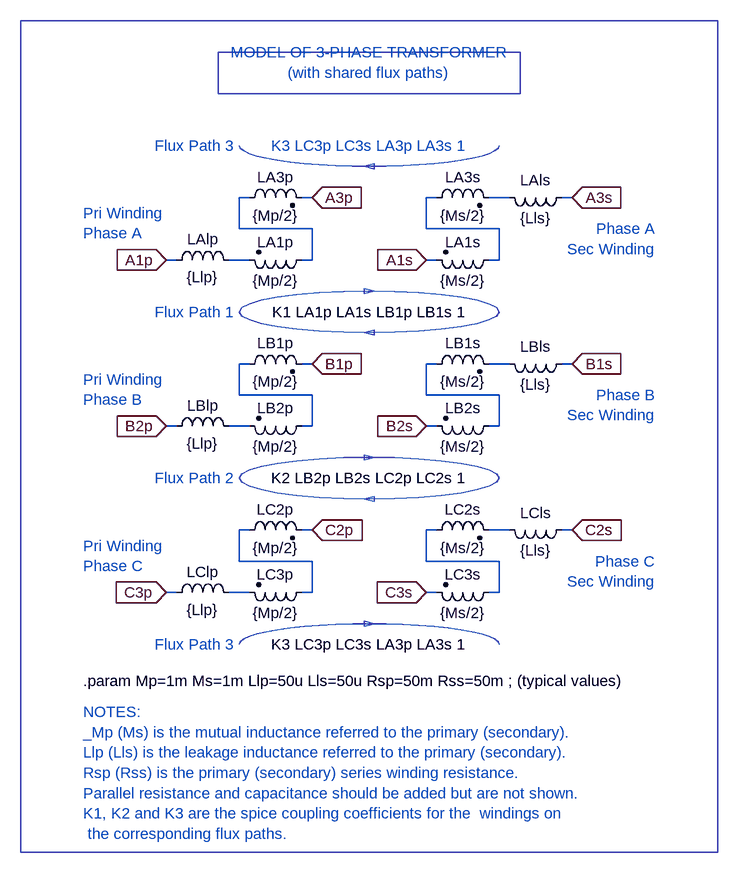
[diagram p0: schematic 3-phase_transformer.asc]
3-phase_transformer.asc, the LTspice schematic file:
Version 4
SHEET 1 1000 948
WIRE 112 32 96 32
WIRE 112 288 96 288
WIRE 112 544 96 544
WIRE 208 -16 208 -64
WIRE 208 240 208 192
WIRE 208 496 208 448
WIRE 224 -64 208 -64
WIRE 224 32 192 32
WIRE 224 192 208 192
WIRE 224 288 192 288
WIRE 224 448 208 448
WIRE 224 544 192 544
WIRE 320 -64 304 -64
WIRE 320 -16 208 -16
WIRE 320 32 304 32
WIRE 320 32 320 -16
WIRE 320 192 304 192
WIRE 320 240 208 240
WIRE 320 288 304 288
WIRE 320 288 320 240
WIRE 320 448 304 448
WIRE 320 496 208 496
WIRE 320 544 304 544
WIRE 320 544 320 496
WIRE 496 -16 496 -64
WIRE 496 240 496 192
WIRE 496 496 496 448
WIRE 512 -64 496 -64
WIRE 512 32 496 32
WIRE 512 192 496 192
WIRE 512 288 496 288
WIRE 512 448 496 448
WIRE 512 544 496 544
WIRE 608 -16 496 -16
WIRE 608 32 592 32
WIRE 608 32 608 -16
WIRE 608 240 496 240
WIRE 608 288 592 288
WIRE 608 288 608 240
WIRE 608 496 496 496
WIRE 608 544 592 544
WIRE 608 544 608 496
WIRE 624 -64 592 -64
WIRE 624 192 592 192
WIRE 624 448 592 448
WIRE 720 -64 704 -64
WIRE 720 192 704 192
WIRE 720 448 704 448
FLAG 720 -64 A3s
IOPIN 720 -64 In
FLAG 496 32 A1s
IOPIN 496 32 In
FLAG 720 192 B1s
IOPIN 720 192 In
FLAG 720 448 C2s
IOPIN 720 448 In
FLAG 496 288 B2s
IOPIN 496 288 In
FLAG 496 544 C3s
IOPIN 496 544 In
FLAG 320 -64 A3p
IOPIN 320 -64 In
FLAG 320 192 B1p
IOPIN 320 192 In
FLAG 320 448 C2p
IOPIN 320 448 In
FLAG 96 32 A1p
IOPIN 96 32 In
FLAG 96 288 B2p
IOPIN 96 288 In
FLAG 96 544 C3p
IOPIN 96 544 In
SYMBOL ind2 208 -48 R270
WINDOW 0 32 56 VTop 0
WINDOW 3 4 56 VBottom 0
SYMATTR InstName LA3p
SYMATTR Value {Mp/2}
SYMATTR Type ind
SYMBOL ind2 320 16 R90
WINDOW 0 4 56 VBottom 0
WINDOW 3 32 56 VTop 0
SYMATTR InstName LA1p
SYMATTR Value {Mp/2}
SYMATTR Type ind
SYMBOL ind2 208 208 R270
WINDOW 0 32 56 VTop 0
WINDOW 3 4 56 VBottom 0
SYMATTR InstName LB1p
SYMATTR Value {Mp/2}
SYMATTR Type ind
SYMBOL ind2 320 272 R90
WINDOW 0 4 56 VBottom 0
WINDOW 3 32 56 VTop 0
SYMATTR InstName LB2p
SYMATTR Value {Mp/2}
SYMATTR Type ind
SYMBOL ind2 208 464 R270
WINDOW 0 32 56 VTop 0
WINDOW 3 4 56 VBottom 0
SYMATTR InstName LC2p
SYMATTR Value {Mp/2}
SYMATTR Type ind
SYMBOL ind2 320 528 R90
WINDOW 0 4 56 VBottom 0
WINDOW 3 32 56 VTop 0
SYMATTR InstName LC3p
SYMATTR Value {Mp/2}
SYMATTR Type ind
SYMBOL ind2 496 -48 R270
WINDOW 0 32 56 VTop 0
WINDOW 3 4 56 VBottom 0
SYMATTR InstName LA3s
SYMATTR Value {Ms/2}
SYMATTR Type ind
SYMBOL ind2 608 16 R90
WINDOW 0 4 56 VBottom 0
WINDOW 3 32 56 VTop 0
SYMATTR InstName LA1s
SYMATTR Value {Ms/2}
SYMATTR Type ind
SYMBOL ind2 496 208 R270
WINDOW 0 32 56 VTop 0
WINDOW 3 4 56 VBottom 0
SYMATTR InstName LB1s
SYMATTR Value {Ms/2}
SYMATTR Type ind
SYMBOL ind2 608 272 R90
WINDOW 0 4 56 VBottom 0
WINDOW 3 32 56 VTop 0
SYMATTR InstName LB2s
SYMATTR Value {Ms/2}
SYMATTR Type ind
SYMBOL ind2 496 464 R270
WINDOW 0 32 56 VTop 0
WINDOW 3 4 56 VBottom 0
SYMATTR InstName LC2s
SYMATTR Value {Ms/2}
SYMATTR Type ind
SYMBOL ind2 608 528 R90
WINDOW 0 4 56 VBottom 0
WINDOW 3 32 56 VTop 0
SYMATTR InstName LC3s
SYMATTR Value {Ms/2}
SYMATTR Type ind
SYMBOL ind 96 48 R270
WINDOW 0 32 56 VTop 0
WINDOW 3 5 56 VBottom 0
SYMATTR InstName LAlp
SYMATTR Value {Llp}
SYMATTR SpiceLine Rser={Rsp}
SYMBOL ind 720 -80 R90
WINDOW 0 5 56 VBottom 0
WINDOW 3 32 56 VTop 0
SYMATTR InstName LAls
SYMATTR Value {Lls}
SYMATTR SpiceLine Rser={Rss}
SYMBOL ind 96 304 R270
WINDOW 0 32 56 VTop 0
WINDOW 3 5 56 VBottom 0
SYMATTR InstName LBlp
SYMATTR Value {Llp}
SYMATTR SpiceLine Rser={Rsp}
SYMBOL ind 720 176 R90
WINDOW 0 5 56 VBottom 0
WINDOW 3 32 56 VTop 0
SYMATTR InstName LBls
SYMATTR Value {Lls}
SYMATTR SpiceLine Rser={Rss}
SYMBOL ind 96 560 R270
WINDOW 0 32 56 VTop 0
WINDOW 3 5 56 VBottom 0
SYMATTR InstName LClp
SYMATTR Value {Llp}
SYMATTR SpiceLine Rser={Rsp}
SYMBOL ind 720 432 R90
WINDOW 0 5 56 VBottom 0
WINDOW 3 32 56 VTop 0
SYMATTR InstName LCls
SYMATTR Value {Lls}
SYMATTR SpiceLine Rser={Rss}
TEXT 408 112 Center 0 !K1 LA1p LA1s LB1p LB1s 1
TEXT 408 368 Center 0 !K2 LB2p LB2s LC2p LC2s 1
TEXT 408 624 Center 0 !K3 LC3p LC3s LA3p LA3s 1
TEXT 408 -144 Center 0 ;K3 LC3p LC3s LA3p LA3s 1
TEXT -32 -40 Left 0 ;Pri Winding\nPhase A
TEXT -32 216 Left 0 ;Pri Winding\nPhase B
TEXT -32 472 Left 0 ;Pri Winding\nPhase C
TEXT 200 112 Right 0 ;Flux Path 1
TEXT 848 -16 Right 0 ;Phase A\nSec Winding
TEXT 200 368 Right 0 ;Flux Path 2
TEXT 200 624 Right 0 ;Flux Path 3
TEXT 200 -144 Right 0 ;Flux Path 3
TEXT 848 240 Right 0 ;Phase B\nSec Winding
TEXT 848 496 Right 0 ;Phase C\nSec Winding
TEXT -32 728 Left 0 ;NOTES:\n_Mp (Ms) is the mutual inductance referred to the primary (secondary).\nLlp (Lls) is the leakage inductance referred to the primary (secondary).\nRsp (Rss) is the primary (secondary) series winding resistance.\nParallel resistance and capacitance should be added but are not shown.\nK1, K2 and K3 are the spice coupling coefficients for the  windings on\n the corresponding flux paths.
TEXT 408 -272 Center 0 ;MODEL OF 3-PHASE TRANSFORMER\n(with shared flux paths)
TEXT -32 680 Left 0 !.param Mp=1m Ms=1m Llp=50u Lls=50u Rsp=50m Rss=50m ; (typical values)
LINE Normal 400 588 416 592
LINE Normal 400 596 400 588
LINE Normal 416 592 400 596
LINE Normal 416 592 416 592
LINE Normal 400 76 416 80
LINE Normal 400 84 400 76
LINE Normal 416 80 400 84
LINE Normal 416 80 416 80
LINE Normal 416 -116 400 -112
LINE Normal 416 -108 416 -116
LINE Normal 400 -112 416 -108
LINE Normal 400 -112 400 -112
LINE Normal 416 140 400 144
LINE Normal 416 148 416 140
LINE Normal 400 144 416 148
LINE Normal 400 144 400 144
LINE Normal 416 396 400 400
LINE Normal 416 404 416 396
LINE Normal 400 400 416 404
LINE Normal 400 400 400 400
LINE Normal 400 332 416 336
LINE Normal 400 340 400 332
LINE Normal 416 336 400 340
LINE Normal 416 336 416 336
RECTANGLE Normal 944 944 -128 -336
RECTANGLE Normal 640 -224 176 -288
CIRCLE Normal 208 144 608 80
CIRCLE Normal 208 400 608 336
ARC Normal 608 -112 208 -176 208 -144 608 -144
ARC Normal 608 656 208 592 608 624 208 624

The netlist it stands for:
* 3-phase_transformer.asc
LA3p N001 A3p {Mp/2}
LA1p N001 N004 {Mp/2}
LB1p N002 B1p {Mp/2}
LB2p N002 N005 {Mp/2}
LC2p N003 C2p {Mp/2}
LC3p N003 N006 {Mp/2}
LA3s N007 N010 {Ms/2}
LA1s N007 A1s {Ms/2}
LB1s N008 N011 {Ms/2}
LB2s N008 B2s {Ms/2}
LC2s N009 N012 {Ms/2}
LC3s N009 C3s {Ms/2}
LAlp A1p N004 {Llp} Rser={Rsp}
LAls A3s N010 {Lls} Rser={Rss}
LBlp B2p N005 {Llp} Rser={Rsp}
LBls B1s N011 {Lls} Rser={Rss}
LClp C3p N006 {Llp} Rser={Rsp}
LCls C2s N012 {Lls} Rser={Rss}
K1 LA1p LA1s LB1p LB1s 1
K2 LB2p LB2s LC2p LC2s 1
K3 LC3p LC3s LA3p LA3s 1
* K3 LC3p LC3s LA3p LA3s 1
* Pri Winding
* Phase A
* Pri Winding
* Phase B
* Pri Winding
* Phase C
* Flux Path 1
* Phase A
* Sec Winding
* Flux Path 2
* Flux Path 3
* Flux Path 3
* Phase B
* Sec Winding
* Phase C
* Sec Winding
* NOTES:
* _Mp (Ms) is the mutual inductance referred to the primary (secondary).
* Llp (Lls) is the leakage inductance referred to the primary (secondary).
* Rsp (Rss) is the primary (secondary) series winding resistance.
* Parallel resistance and capacitance should be added but are not shown.
* K1, K2 and K3 are the spice coupling coefficients for the  windings on
*  the corresponding flux paths.
* MODEL OF 3-PHASE TRANSFORMER
* (with shared flux paths)
.param Mp=1m Ms=1m Llp=50u Lls=50u Rsp=50m Rss=50m ; (typical values)
.backanno
.end